# Altium schematic sheet 7Segment.SchDoc
size Letter; SheetNumber: 6; SheetTotal: 22
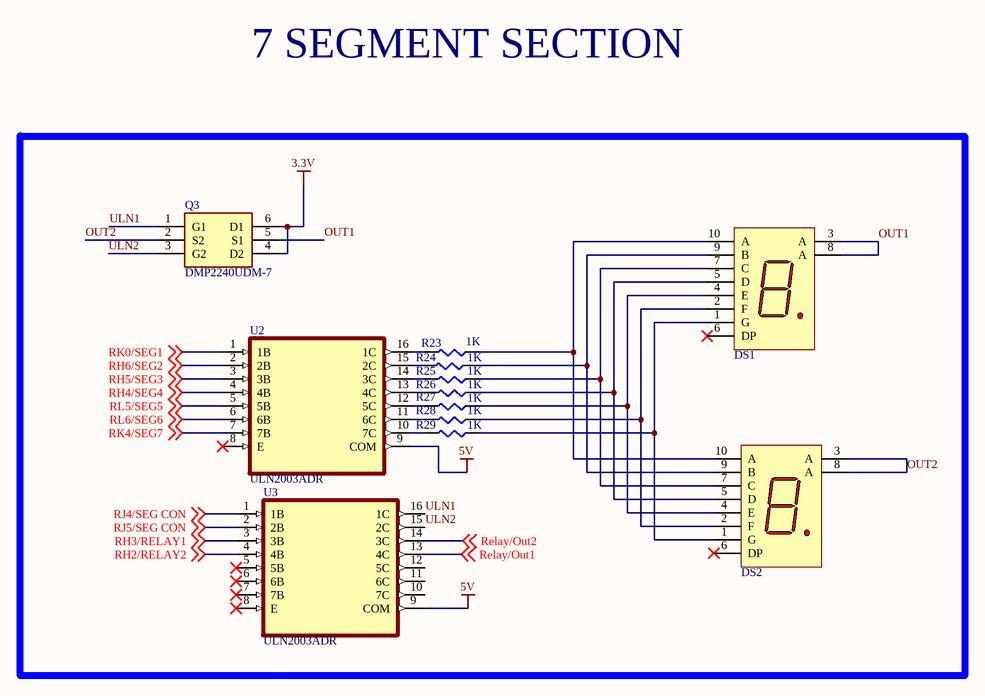
[diagram p0: 7Segment.SchDoc]

## Parts
DS1  157119S12801  [WL-T7DS_L13W10H7]  (value not drawn)
DS2  157119S12801  [WL-T7DS_L13W10H7]  (value not drawn)
Q3  DMP2240UDM-7  [SOT95P285X140-6N]
R23  1K  [SMD-0805-RES]
R24  1K  [SMD-0805-RES]
R25  1K  [SMD-0805-RES]
R26  1K  [SMD-0805-RES]
R27  1K  [SMD-0805-RES]
R28  1K  [SMD-0805-RES]
R29  1K  [SMD-0805-RES]
U2  ULN2003ADR  [SOIC127P600X175-16N]
U3  ULN2003ADR  [SOIC127P600X175-16N]

## Nets
3.3V: Q3.4(D2) Q3.6(D1)
5V: U2.9(COM) U3.9(COM)
OUT1: DS1.3(A) DS1.8(A) Q3.5(S1)
OUT2: DS2.3(A) DS2.8(A) Q3.2(S2)
Relay/Out1: U3.13(4C) ; off-sheet Relay/Out1
Relay/Out2: U3.14(3C) ; off-sheet Relay/Out2
RH2/RELAY2: U3.4(4B) ; off-sheet RH2/RELAY2
RH3/RELAY1: U3.3(3B) ; off-sheet RH3/RELAY1
RH4/SEG4: U2.4(4B) ; off-sheet RH4/SEG4
RH5/SEG3: U2.3(3B) ; off-sheet RH5/SEG3
RH6/SEG2: U2.2(2B) ; off-sheet RH6/SEG2
RJ4/SEG CON: U3.1(1B) ; off-sheet RJ4/SEG CON
RJ5/SEG CON: U3.2(2B) ; off-sheet RJ5/SEG CON
RK0/SEG1: U2.1(1B) ; off-sheet RK0/SEG1
RK4/SEG7: U2.7(7B) ; off-sheet RK4/SEG7
RL5/SEG5: U2.5(5B) ; off-sheet RL5/SEG5
RL6/SEG6: U2.6(6B) ; off-sheet RL6/SEG6
ULN1: Q3.1(G1) U3.16(1C)
ULN2: Q3.3(G2) U3.15(2C)
NetDS1_1: DS1.1(G) DS2.1(G) R29.1
NetDS1_2: DS1.2(F) DS2.2(F) R28.1
NetDS1_4: DS1.4(E) DS2.4(E) R27.1
NetDS1_5: DS1.5(D) DS2.5(D) R26.1
NetDS1_7: DS1.7(C) DS2.7(C) R25.1
NetDS1_9: DS1.9(B) DS2.9(B) R24.1
NetDS1_10: DS1.10(A) DS2.10(A) R23.1
NetR23_2: R23.2 U2.16(1C)
NetR24_2: R24.2 U2.15(2C)
NetR25_2: R25.2 U2.14(3C)
NetR26_2: R26.2 U2.13(4C)
NetR27_2: R27.2 U2.12(5C)
NetR28_2: R28.2 U2.11(6C)
NetR29_2: R29.2 U2.10(7C)

Not connected (* = marked no-connect by the designer): DS1 6(DP)*; DS2 6(DP)*; U2 8(E)*; U3 5(5B)* 6(6B)* 7(7B)* 8(E)* 10(7C) 11(6C) 12(5C)

## Notes on the sheet
- 7 SEGMENT SECTION

## Library data of the parts
DS1 DS2 = 157119S12801: WL-T7DS 7 Segments Display THT Single Digit, 0.39"/ 9.9mm, Common Anode, 38mcd, 2V, Super Red; Manufacturer: Wurth Elektronik; ComponentLink1Description: Website Link; ComponentLink1URL: https://www.we-online.com/redexpert/article/157119S12801?ad; ComponentLink2Description: Datasheet Link; ComponentLink2URL: https://www.we-online.com/redexpert/spec/157119S12801?ad; Manufacturer Part Number: 157119S12801; Category: 7 Segments Display; Match Code: WL-T7DS; Mount: Through Hole; Operating Temperature Max: 85°C; Operating Temperature Min: -40°C; Packaging: Tube; Length: 13mm; Width: 10mm; Height: 7mm; Circuitry: Common Anode; Display Height: 0.39"/ 9.9mm; Emitting Color: Super Red; Forward Voltage: 2V; Luminous Intensity: 38mcd
Q3 = DMP2240UDM-7: MOSFET (P-Channel); Manufacturer_Name: Diodes Inc.; Datasheet Link: https://www.diodes.com/assets/Datasheets/ds31197.pdf; Height: 1.4mm; Manufacturer_Part_Number: DMP2240UDM-7; Mouser Part Number: 621-DMP2240UDM-7; Mouser Price/Stock: https://www.mouser.co.uk/ProductDetail/Diodes-Incorporated/DMP2240UDM-7?qs=mno522deGfakW12JLK9H1A%3D%3D; Arrow Part Number: DMP2240UDM-7; Arrow Price/Stock: https://www.arrow.com/en/products/dmp2240udm-7/diodes-incorporated?region=nac
R23-R29 = ERJ-6ENF1001V: RES SMD 1K OHM 1% 1/8W 0805; Manufacturer: Panasonic Electronic Components; Factory Stock: 0; Unit Price (USD): 0.00729; @ qty: 1500; Minimum Quantity: 1; Power (Watts): 0.125W, 1/8W; Temperature Coefficient: ±100ppm/°C; Part Number: ERJ-6ENF1001V; Datasheets: http://industrial.panasonic.com/www-cgi/jvcr13pz.cgi?E+PZ+3+AOA0002+ERJ6ENF1001V+7+WW; Image: //media.digikey.com/Renders/Panasonic%20Renders/ERJ-0805%20Pkg.jpg; Digi-Key Part Number: P1.00KCCT-ND; Quantity Available: 12895103; Packaging: Cut Tape (CT); Series: ERJ; Part Status: Active; Value: 1k; Tolerance: ±1%; Composition: Thick Film; Features: Automotive AEC-Q200; Operating Temperature: -55°C ~ 155°C; Package / Case: 0805 (2012 Metric); Supplier Device Package: 0805; Size / Dimension: 0.079" L x 0.049" W (2.00mm x 1.25mm); Height - Seated (Max): 0.028" (0.70mm); Number of Terminations: 2; Failure Rate: -
U2 U3 = ULN2003ADR: 50-V, 7-ch darlington transistor array, -20C to 70C; MF: Texas Instruments; Value: *; Check_prices: https://www.snapeda.com/parts/ULN2003ADR/Texas+Instruments/view-part/?ref=eda; Availability: In Stock; Price: None; Package: SOIC-16 Texas Instruments; Purchase-URL: https://pricing.snapeda.com/search/part/ULN2003ADR/?ref=eda; SnapEDA_Link: https://www.snapeda.com/parts/ULN2003ADR/Texas+Instruments/view-part/?ref=snap; MP: ULN2003ADR